# Altium schematic sheet Main.SchDoc
size A4
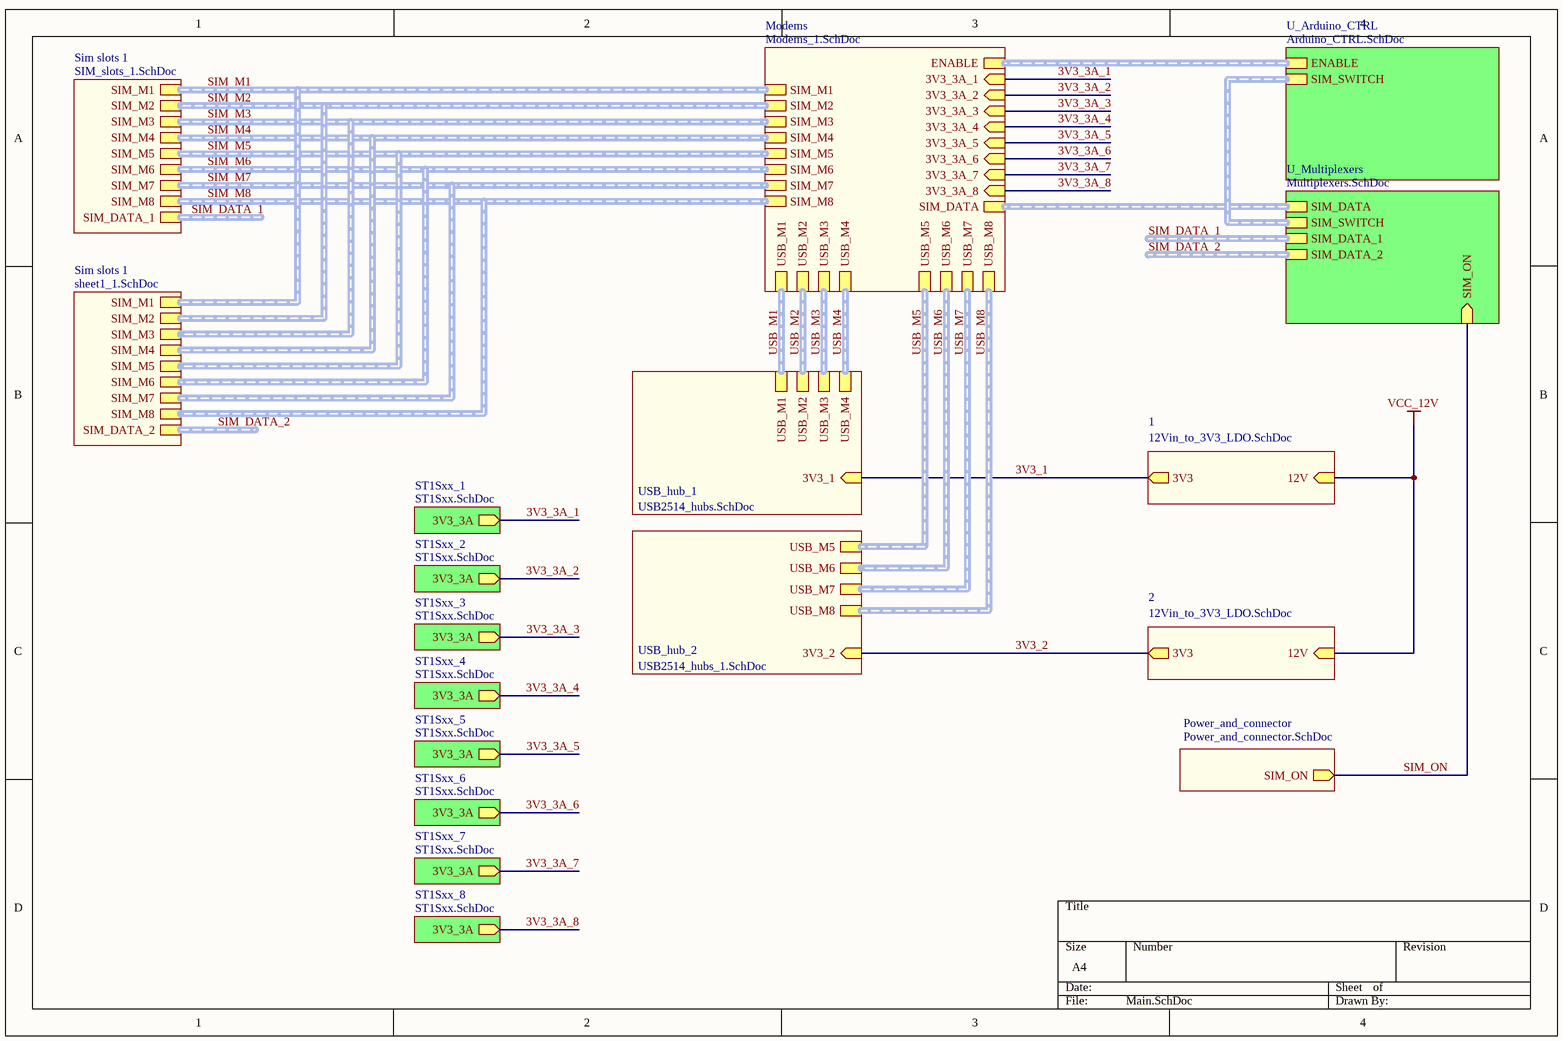
[diagram p0: Main.SchDoc]

## Sub-sheets
1 = 12Vin_to_3V3_LDO.SchDoc: 3V3 (out), 12V (in)
2 = 12Vin_to_3V3_LDO.SchDoc: 3V3 (out), 12V (in)
Modems = Modems_1.SchDoc: SIM_M4 (harness SIM), SIM_M5 (harness SIM), SIM_M6 (harness SIM), SIM_M7 (harness SIM), USB_M5 (harness DIFF), USB_M6 (harness DIFF), USB_M8 (harness DIFF), USB_M7 (harness DIFF), USB_M2 (harness DIFF), USB_M4 (harness DIFF), USB_M3 (harness DIFF), USB_M1 (harness DIFF), SIM_M8 (harness SIM), SIM_M3 (harness SIM), SIM_M2 (harness SIM), SIM_M1 (harness SIM), 3V3_3A_4 (in), 3V3_3A_3 (in), 3V3_3A_2 (in), 3V3_3A_1 (in), SIM_DATA (harness SIM_DATA), ENABLE (harness ENABLE), 3V3_3A_6 (in), 3V3_3A_5 (in), 3V3_3A_8 (in), 3V3_3A_7 (in)
Power_and_connector = Power_and_connector.SchDoc: SIM_ON (out)
Sim slots 1 = SIM_slots_1.SchDoc: SIM_M4 (harness SIM), SIM_M5 (harness SIM), SIM_M2 (harness SIM), SIM_M3 (harness SIM), SIM_M6 (harness SIM), SIM_M1 (harness SIM), SIM_M7 (harness SIM), SIM_M8 (harness SIM), SIM_DATA_1 (harness SIM_DATA)
Sim slots 1 = sheet1_1.SchDoc: SIM_M4 (harness SIM), SIM_M5 (harness SIM), SIM_M2 (harness SIM), SIM_M3 (harness SIM), SIM_M6 (harness SIM), SIM_M1 (harness SIM), SIM_M7 (harness SIM), SIM_M8 (harness SIM), SIM_DATA_2 (harness SIM_DATA)
ST1Sxx_1 = ST1Sxx.SchDoc: 3V3_3A (out)
ST1Sxx_2 = ST1Sxx.SchDoc: 3V3_3A (out)
ST1Sxx_3 = ST1Sxx.SchDoc: 3V3_3A (out)
ST1Sxx_4 = ST1Sxx.SchDoc: 3V3_3A (out)
ST1Sxx_5 = ST1Sxx.SchDoc: 3V3_3A (out)
ST1Sxx_6 = ST1Sxx.SchDoc: 3V3_3A (out)
ST1Sxx_7 = ST1Sxx.SchDoc: 3V3_3A (out)
ST1Sxx_8 = ST1Sxx.SchDoc: 3V3_3A (out)
U_Arduino_CTRL = Arduino_CTRL.SchDoc: ENABLE (harness ENABLE), SIM_SWITCH (harness SIM_SWITCH)
U_Multiplexers = Multiplexers.SchDoc: SIM_DATA (harness SIM_DATA), SIM_SWITCH (harness SIM_SWITCH), SIM_DATA_2 (harness SIM_DATA), SIM_DATA_1 (harness SIM_DATA), SIM_ON (in)
USB_hub_1 = USB2514_hubs.SchDoc: USB_M1 (harness DIFF), USB_M2 (harness DIFF), USB_M4 (harness DIFF), USB_M3 (harness DIFF), 3V3_1 (in)
USB_hub_2 = USB2514_hubs_1.SchDoc: USB_M8 (harness DIFF), USB_M7 (harness DIFF), USB_M6 (harness DIFF), USB_M5 (harness DIFF), 3V3_2 (in)

## Nets
VCC_12V: sheet 1/12V, sheet 2/12V
3V3_1: sheet USB_hub_1/3V3_1, sheet 1/3V3
3V3_2: sheet USB_hub_2/3V3_2, sheet 2/3V3
3V3_3A_1: sheet Modems/3V3_3A_1, sheet ST1Sxx_1/3V3_3A
3V3_3A_2: sheet Modems/3V3_3A_2, sheet ST1Sxx_2/3V3_3A
3V3_3A_3: sheet Modems/3V3_3A_3, sheet ST1Sxx_3/3V3_3A
3V3_3A_4: sheet Modems/3V3_3A_4, sheet ST1Sxx_4/3V3_3A
3V3_3A_5: sheet Modems/3V3_3A_5, sheet ST1Sxx_5/3V3_3A
3V3_3A_6: sheet Modems/3V3_3A_6, sheet ST1Sxx_6/3V3_3A
3V3_3A_7: sheet Modems/3V3_3A_7, sheet ST1Sxx_7/3V3_3A
3V3_3A_8: sheet Modems/3V3_3A_8, sheet ST1Sxx_8/3V3_3A
SIM_ON: sheet Power_and_connector/SIM_ON, sheet U_Multiplexers/SIM_ON

## Buses and harness runs
harness sheet Modems/ENABLE = sheet U_Arduino_CTRL/ENABLE
harness sheet Modems/SIM_DATA = sheet U_Multiplexers/SIM_DATA
harness sheet U_Arduino_CTRL/SIM_SWITCH = sheet U_Multiplexers/SIM_SWITCH
harness SIM_DATA_1 = sheet Sim slots 1/SIM_DATA_1
harness SIM_DATA_1 = sheet U_Multiplexers/SIM_DATA_1
harness SIM_DATA_2 = sheet Sim slots 1/SIM_DATA_2
harness SIM_DATA_2 = sheet U_Multiplexers/SIM_DATA_2
harness SIM_M1 = sheet Modems/SIM_M1 = sheet Sim slots 1/SIM_M1
harness SIM_M2 = sheet Modems/SIM_M2 = sheet Sim slots 1/SIM_M2
harness SIM_M3 = sheet Modems/SIM_M3 = sheet Sim slots 1/SIM_M3
harness SIM_M4 = sheet Modems/SIM_M4 = sheet Sim slots 1/SIM_M4
harness SIM_M5 = sheet Modems/SIM_M5 = sheet Sim slots 1/SIM_M5
harness SIM_M6 = sheet Modems/SIM_M6 = sheet Sim slots 1/SIM_M6
harness SIM_M7 = sheet Modems/SIM_M7 = sheet Sim slots 1/SIM_M7
harness SIM_M8 = sheet Modems/SIM_M8 = sheet Sim slots 1/SIM_M8
harness USB_M1 = sheet Modems/USB_M1 = sheet USB_hub_1/USB_M1
harness USB_M2 = sheet Modems/USB_M2 = sheet USB_hub_1/USB_M2
harness USB_M3 = sheet Modems/USB_M3 = sheet USB_hub_1/USB_M3
harness USB_M4 = sheet Modems/USB_M4 = sheet USB_hub_1/USB_M4
harness USB_M5 = sheet Modems/USB_M5 = sheet USB_hub_2/USB_M5
harness USB_M6 = sheet Modems/USB_M6 = sheet USB_hub_2/USB_M6
harness USB_M7 = sheet Modems/USB_M7 = sheet USB_hub_2/USB_M7
harness USB_M8 = sheet Modems/USB_M8 = sheet USB_hub_2/USB_M8